# Altium schematic sheet SHEET1.SCHDOC
size A4
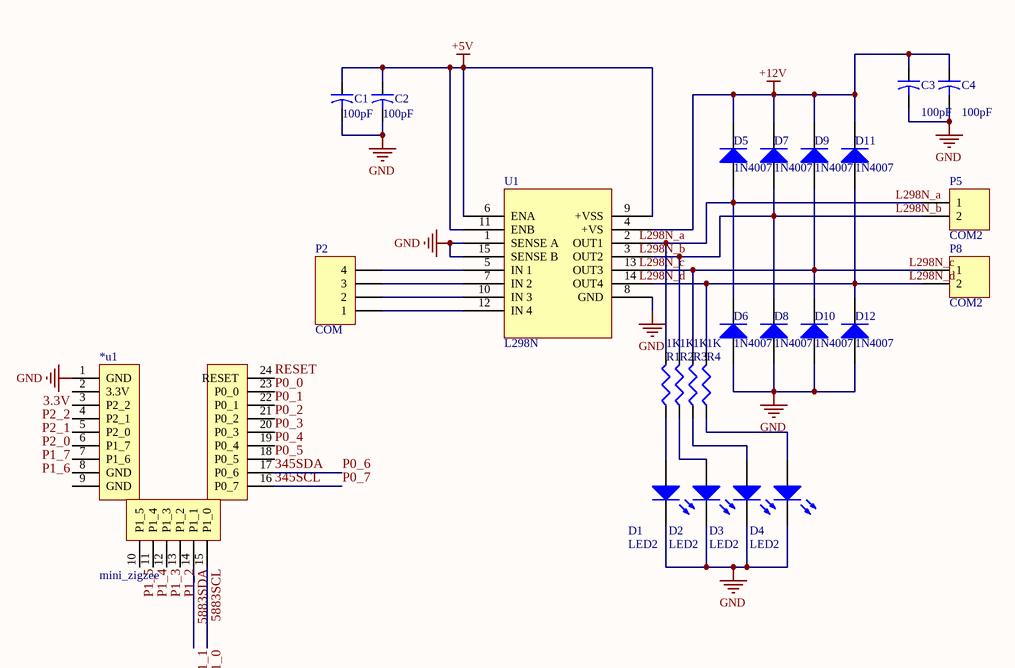
[diagram p0: SHEET1.SCHDOC]

## Parts
*u1  mini_zigzee  [mini_zigbee]
C1  value 100pF  [CAPR5-4X5]
C2  value 100pF  [CAPR5-4X5]
C3  value 100pF  [CAPR5-4X5]
C4  value 100pF  [CAPR5-4X5]
D1  LED2  [3.2X1.6X1.1]
D2  LED2  [3.2X1.6X1.1]
D3  LED2  [3.2X1.6X1.1]
D4  LED2  [3.2X1.6X1.1]
D5  1N4007  [DO-41]
D6  1N4007  [DO-41]
D7  1N4007  [DO-41]
D8  1N4007  [DO-41]
D9  1N4007  [DO-41]
D10  1N4007  [DO-41]
D11  1N4007  [DO-41]
D12  1N4007  [DO-41]
P2  COM  [HDR1X4]
P5  COM2  [DP3]
P8  COM2  [DP3]
R1  value 1K  [J1-0603]  (hidden comment: Res3)
R2  value 1K  [J1-0603]  (hidden comment: Res3)
R3  value 1K  [J1-0603]  (hidden comment: Res3)
R4  value 1K  [J1-0603]  (hidden comment: Res3)
U1  L298N  [L298N - duplicate]

## Nets
+5V: C1.1 C2.1 U1.6(ENA) U1.9(+VSS) U1.11(ENB)
+12V: C3.1 C4.1 D5.2(K) D7.2(K) D9.2(K) D11.2(K) U1.4(+VS)
GND: *u1.1(GND) C1.2 C2.2 C3.2 C4.2 D1.2(K) D2.2(K) D3.2(K) D4.2(K) D6.1(A) D8.1(A) D10.1(A) D12.1(A) U1.1(SENSE_A) U1.8(GND) U1.15(SENSE_B)
3.3V: *u1.2(3.3V)
345SCL: *u1.16(P0_7)  [also labelled P0_7]
345SDA: *u1.17(P0_6)  [also labelled P0_6]
5883SCL: *u1.15(P1_0)  [also labelled P1_0]
5883SDA: *u1.14(P1_1)  [also labelled P1_1]
L298N_a: D5.1(A) D6.2(K) P5.1 R1.2 U1.2(OUT1)
L298N_b: D7.1(A) D8.2(K) P5.2 R2.2 U1.3(OUT2)
L298N_c: D9.1(A) D10.2(K) P8.1 R3.2 U1.13(OUT3)
L298N_d: D11.1(A) D12.2(K) P8.2 R4.2 U1.14(OUT4)
P0_0: *u1.23(P0_0)
P0_1: *u1.22(P0_1)
P0_2: *u1.21(P0_2)
P0_3: *u1.20(P0_3)
P0_4: *u1.19(P0_4)
P0_5: *u1.18(P0_5)
P1_2: *u1.13(P1_2)
P1_3: *u1.12(P1_3)
P1_4: *u1.11(P1_4)
P1_5: *u1.10(P1_5)
P1_6: *u1.7(P1_6)
P1_7: *u1.6(P1_7)
P2_0: *u1.5(P2_0)
P2_1: *u1.4(P2_1)
P2_2: *u1.3(P2_2)
RESET: *u1.24(RESET)
NetD1_1: D1.1(A) R1.1
NetD2_1: D2.1(A) R2.1
NetD3_1: D3.1(A) R3.1
NetD4_1: D4.1(A) R4.1
NetP2_1: P2.1 U1.12(IN_4)
NetP2_2: P2.2 U1.10(IN_3)
NetP2_3: P2.3 U1.7(IN_2)
NetP2_4: P2.4 U1.5(IN_1)

Not connected (* = marked no-connect by the designer): *u1 8(GND) 9(GND)

## Notes on the sheet
- Labels drawn without touching a wire or pin: L298N_a, L298N_b, L298N_c, L298N_d

## Library data of the parts
C1-C4 = Cap2: Capacitor; Published: 23-Sep-2002; PackageReference: CAPR5-4X5; Publisher: Altium Limited
D1-D4 = LED2: Typical RED, GREEN, YELLOW, AMBER GaAs LED; Published: 8-Jun-2000; LatestRevisionDate: 17-Jul-2002; LatestRevisionNote: Re-released for DXP Platform.; PackageVersion: Feb-2002; PackageReference: 3.2X1.6X1.1; Publisher: Altium Limited; PackageDescription: SM LED; 2 Flat Leads
D5-D12 = Diode 1N4007: 1 Amp General Purpose Rectifier; Published: 8-Jun-2000; LatestRevisionDate: 17-Jul-2002; LatestRevisionNote: Re-released for DXP Platform.; DatasheetDocument: 1998; PackageDocument: Aug-1999; PackageReference: DO-41; Publisher: Altium Limited; Code_JEDEC: DO-204-AL; ComponentLink1Description: Manufacturer Link; ComponentLink1URL: http://www.fairchildsemi.com/; ComponentLink2Description: Datasheet; ComponentLink2URL: http://www.fairchildsemi.com/ds/1N%2F1N4001.pdf
P2 = Header 4: Header, 4-Pin; LatestRevisionDate: 17-Jul-2002; LatestRevisionNote: Re-released for DXP Platform.; Publisher: Altium Limited
P5 P8 = Header 2: Header, 2-Pin; LatestRevisionDate: 17-Jul-2002; LatestRevisionNote: Re-released for DXP Platform.; Publisher: Altium Limited
R1-R4 = Res3: Resistor; Published: 8-Jun-2000; LatestRevisionDate: 29-May-2009; LatestRevisionNote: IPC-7351 Footprint Added.; PackageReference: J1-0603; Publisher: Altium Limited; PackageDescription: Chip Resistor